# EAGLE design GT_pos_router (EAGLE 9.1.1)
REV: 1; TITLE: GoTab POS Router
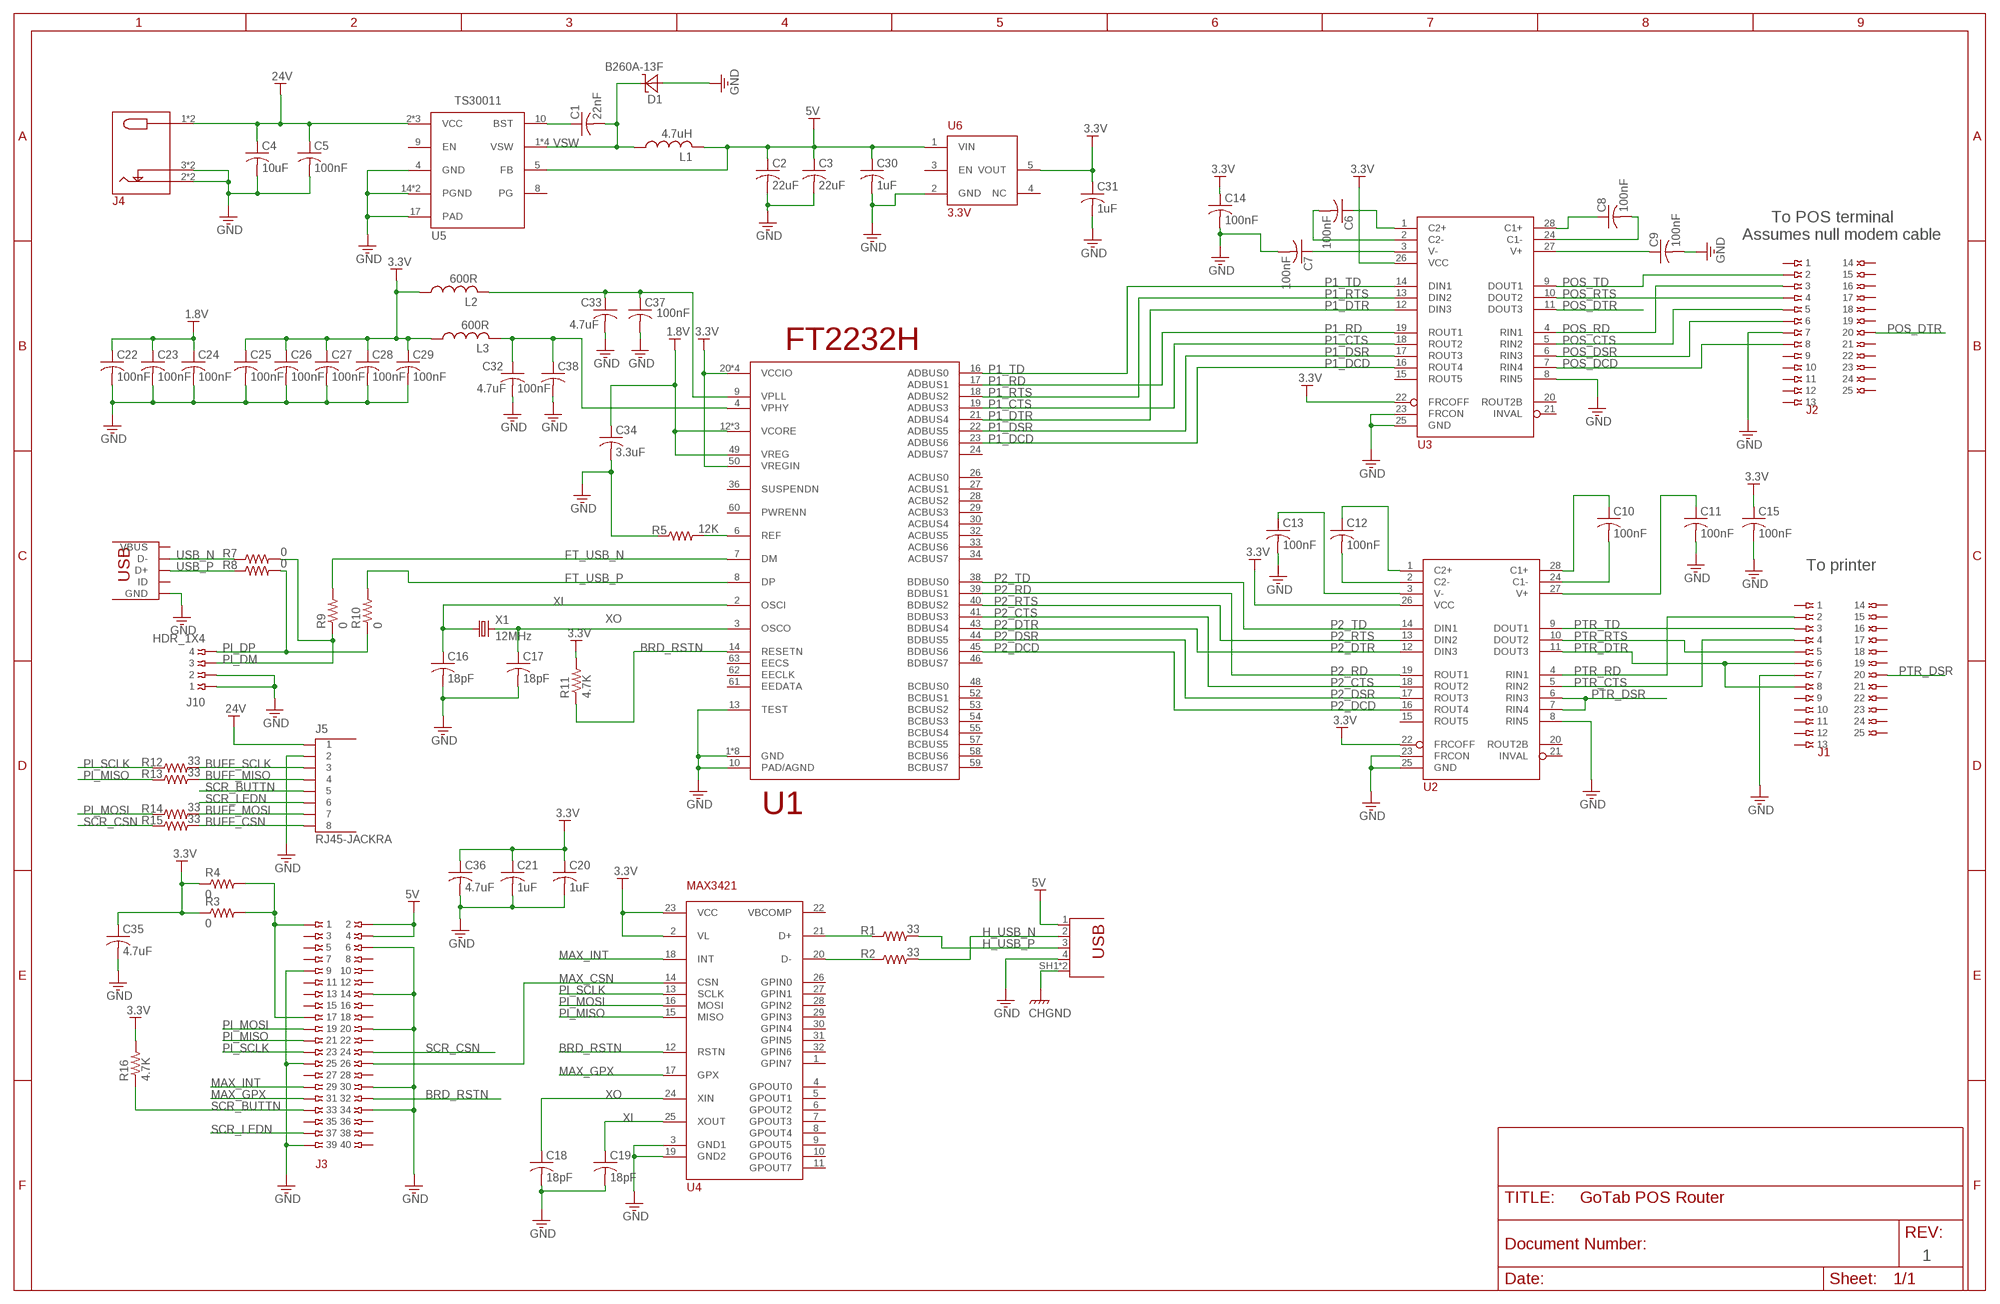
[diagram p0: schematic, sheet 1]

## Parts
C1  22nF  C0402-22NF-16V-10-X7R  [CAPC100X50X55L25N]
C2  22uF  C1206-22UF-25V-20-X5R  [CAPC3216X85L50N]
C3  22uF  C1206-22UF-25V-20-X5R  [CAPC3216X85L50N]
C4  10uF  C1206-10UF-35V-10-X5R  [CAPC3216X85L50N]
C5  100nF  C0603-100NF-50V-5-X7R  [CAPC1608X87L35N]
C6  100nF  C0603-100NF-50V-5-X7R  [CAPC1608X87L35N]
C7  100nF  C0603-100NF-50V-5-X7R  [CAPC1608X87L35N]
C8  100nF  C0603-100NF-50V-5-X7R  [CAPC1608X87L35N]
C9  100nF  C0603-100NF-50V-5-X7R  [CAPC1608X87L35N]
C10  100nF  C0603-100NF-50V-5-X7R  [CAPC1608X87L35N]
C11  100nF  C0603-100NF-50V-5-X7R  [CAPC1608X87L35N]
C12  100nF  C0603-100NF-50V-5-X7R  [CAPC1608X87L35N]
C13  100nF  C0603-100NF-50V-5-X7R  [CAPC1608X87L35N]
C14  100nF  C0603-100NF-50V-5-X7R  [CAPC1608X87L35N]
C15  100nF  C0603-100NF-50V-5-X7R  [CAPC1608X87L35N]
C16  18pF  C0402-18PF-50V-5-NPO  [CAPC100X50X55L25N]
C17  18pF  C0402-18PF-50V-5-NPO  [CAPC100X50X55L25N]
C18  18pF  C0402-18PF-50V-5-NPO  [CAPC100X50X55L25N]
C19  18pF  C0402-18PF-50V-5-NPO  [CAPC100X50X55L25N]
C20  1uF  C0603-1UF-16V-10-X7R  [CAPC1608X87L35N]
C21  1uF  C0603-1UF-16V-10-X7R  [CAPC1608X87L35N]
C22  100nF  C0402-100NF-16V-10-X7R  [CAPC100X50X55L25N]
C23  100nF  C0402-100NF-16V-10-X7R  [CAPC100X50X55L25N]
C24  100nF  C0402-100NF-16V-10-X7R  [CAPC100X50X55L25N]
C25  100nF  C0402-100NF-16V-10-X7R  [CAPC100X50X55L25N]
C26  100nF  C0402-100NF-16V-10-X7R  [CAPC100X50X55L25N]
C27  100nF  C0402-100NF-16V-10-X7R  [CAPC100X50X55L25N]
C28  100nF  C0402-100NF-16V-10-X7R  [CAPC100X50X55L25N]
C29  100nF  C0402-100NF-16V-10-X7R  [CAPC100X50X55L25N]
C30  1uF  C0603-1UF-16V-10-X7R  [CAPC1608X87L35N]
C31  1uF  C0603-1UF-16V-10-X7R  [CAPC1608X87L35N]
C32  4.7uF  C0805-4.7UF-10V-10-X7R  [CAPC2012X140L50N]
C33  4.7uF  C0805-4.7UF-10V-10-X7R  [CAPC2012X140L50N]
C34  3.3uF  C0603-3.3UF-6.3V-10-X5R  [CAPC1608X87L35N]
C35  4.7uF  C0805-4.7UF-10V-10-X7R  [CAPC2012X140L50N]
C36  4.7uF  C0805-4.7UF-10V-10-X7R  [CAPC2012X140L50N]
C37  100nF  C0402-100NF-16V-10-X7R  [CAPC100X50X55L25N]
C38  100nF  C0402-100NF-16V-10-X7R  [CAPC100X50X55L25N]
D1  B260A-13F  [SODFL430X260X240L114X145N]
J1  DB25-RA-MALE  [DB25-RA-MALE]
J2  DB25-RA-FEMALE  [DB25-RA-FEMALE]
J3  RPI_ZERO_HDR0.2_STACK  [RPI_ZERO_HDR]
J4  PWR_JACK_SW_NC  [PJ-202B]
J5  RJ45-JACKRA  [RJ45-RA]
J8  USB-MICRO-B-SMT-FLG  [10118192-0001LF]
J9  USB-A-RECEPT-RA  [SS-52100-001]
J10  HDR_1X4  [HDR_0.1IN_1X4_1MM]
L1  4.7uH  L-SRN4026-4.7UH  [SRN4026]
L2  600R  L0402-600R-0.3A  [INDC100X50X55L25N]
L3  600R  L0402-600R-0.3A  [INDC100X50X55L25N]
R1  33  R0402-33-1/16W/-1  [RESC1005X40L25N]
R2  33  R0402-33-1/16W/-1  [RESC1005X40L25N]
R3  0  R0402-0-1/16W  [RESC1005X40L25N]
R4  0  R0402-0-1/16W  [RESC1005X40L25N]
R5  12K  R0402-12K-1/16W-1  [RESC1005X40L25N]
R7  0  R0402-0-1/16W  [RESC1005X40L25N]
R8  0  R0402-0-1/16W  [RESC1005X40L25N]
R9  0  R0402-0-1/16W  [RESC1005X40L25N]
R10  0  R0402-0-1/16W  [RESC1005X40L25N]
R11  4.7K  R0402-4.7K-1/16W-1  [RESC1005X40L25N]
R12  33  R0402-33-1/16W/-1  [RESC1005X40L25N]
R13  33  R0402-33-1/16W/-1  [RESC1005X40L25N]
R14  33  R0402-33-1/16W/-1  [RESC1005X40L25N]
R15  33  R0402-33-1/16W/-1  [RESC1005X40L25N]
R16  4.7K  R0402-4.7K-1/16W-1  [RESC1005X40L25N]
U1  FT2232H  [LQFP64P050_120X120X160N]
U2  MAX3243ST-EB  [TSSOP28]
U3  MAX3243ST-EB  [TSSOP28]
U4  MAX3421  [TQFP32P050_50X50X120N]
U5  TS30011  [QFN16P05_3X3X10T17X17N]
U6  3.3V  MIC5504  [SOT23-5P95_280X160L40X40N]
X1  12MHz  ABLS2-12M  [ABLS2]

## Nets
1.8V: C22.1 C23.1 C24.1 C34.1 U1.12(VCORE) U1.37(VCORE) U1.49(VREG) U1.64(VCORE)
3.3V: C14.1 C15.1 C20.1 C21.1 C25.1 C26.1 C27.1 C28.1 C29.1 C31.1 C35.1 C36.1 L2.1 L3.1 R3.1 R4.1 R11.2 R16.2 U1.20(VCCIO) U1.31(VCCIO) U1.42(VCCIO) U1.50(VREGIN) U1.56(VCCIO) U2.22(FRCOFF) U2.26(VCC) U3.22(FRCOFF) U3.26(VCC) U4.2(VL) U4.23(VCC) U6.5(VOUT)
5V: C2.1 C3.1 C30.1 J3.2 J3.4 J9.1(VBUS) L1.2 U5.5(FB) U6.1(VIN)
24V: C4.1 C5.1 J4.1 J4.4 J5.1 U5.2(VCC) U5.3(VCC) U5.11(VCC)
BRD_RSTN: J3.32 R11.1 U1.14(RESETN) U4.12(RSTN)
BUFF_CSN: J5.8 R15.2
BUFF_MISO: J5.4 R13.2
BUFF_MOSI: J5.7 R14.2
BUFF_SCLK: J5.3 R12.2
CHGND: J9.SH1(SHELL) J9.SH2(SHELL)
FT_USB_N [USB]: R9.2 U1.7(DM)
FT_USB_P [USB]: R10.2 U1.8(DP)
GND: C2.2 C3.2 C4.2 C5.2 C7.2 C9.2 C11.2 C13.2 C14.2 C15.2 C16.2 C17.2 C18.2 C19.2 C20.2 C21.2 C22.2 C23.2 C24.2 C25.2 C26.2 C27.2 C28.2 C29.2 C30.2 C31.2 C32.2 C33.2 C34.2 C35.2 C36.2 C37.2 C38.2 D1.A J1.7 J2.7 J3.6 J3.9 J3.14 J3.20 J3.25 J3.30 J3.34 J3.39 J4.2 J4.3 J4.5 J4.6 J5.2 J8.5(GND) J9.4(GND) J10.1 J10.2 R5.1 U1.1(GND) U1.5(GND) U1.10(PAD/AGND) U1.11(GND) U1.13(TEST) U1.15(GND) U1.25(GND) U1.35(GND) U1.47(GND) U1.51(GND) U2.8(RIN5) U2.23(FRCON) U2.25(GND) U3.8(RIN5) U3.23(FRCON) U3.25(GND) U4.3(GND1) U4.19(GND2) U5.4(GND) U5.14(PGND) U5.15(PGND) U5.17(PAD) U6.2(GND)
H_USB_N [USB]: J9.2(D-) R2.2
H_USB_P [USB]: J9.3(D+) R1.2
MAX_CSN: J3.26 U4.14(CSN)
MAX_GPX: J3.31 U4.17(GPX)
MAX_INT: J3.29 U4.18(INT)
N$1: R1.1 U4.21(D+)
N$2: R2.1 U4.20(D-)
N$8: C1.1 U5.10(BST)
N$15: C6.1 U3.1(C2+)
N$16: C6.2 U3.2(C2-)
N$17: C7.1 U3.3(V-)
N$18: C33.1 C37.1 L2.2 U1.9(VPLL)
N$19: C8.1 U3.28(C1+)
N$20: C8.2 U3.24(C1-)
N$21: C9.1 U3.27(V+)
N$22: C32.1 C38.1 L3.2 U1.4(VPHY)
N$23: R5.2 U1.6(REF)
N$24: C13.1 U2.3(V-)
N$25: C12.2 U2.2(C2-)
N$26: C12.1 U2.1(C2+)
N$27: C10.1 U2.28(C1+)
N$28: C10.2 U2.24(C1-)
N$29: C11.1 U2.27(V+)
N$31: J3.1 J3.17 R3.2 R4.2
P1_CTS: U1.19(ADBUS3) U3.18(ROUT2)
P1_DCD: U1.23(ADBUS6) U3.16(ROUT4)
P1_DSR: U1.22(ADBUS5) U3.17(ROUT3)
P1_DTR: U1.21(ADBUS4) U3.12(DIN3)
P1_RD: U1.17(ADBUS1) U3.19(ROUT1)
P1_RTS: U1.18(ADBUS2) U3.13(DIN2)
P1_TD: U1.16(ADBUS0) U3.14(DIN1)
P2_CTS: U1.41(BDBUS3) U2.18(ROUT2)
P2_DCD: U1.45(BDBUS6) U2.16(ROUT4)
P2_DSR: U1.44(BDBUS5) U2.17(ROUT3)
P2_DTR: U1.43(BDBUS4) U2.12(DIN3)
P2_RD: U1.39(BDBUS1) U2.19(ROUT1)
P2_RTS: U1.40(BDBUS2) U2.13(DIN2)
P2_TD: U1.38(BDBUS0) U2.14(DIN1)
PI_DM [USB]: J10.3 R7.2 R9.1
PI_DP [USB]: J10.4 R8.2 R10.1
PI_MISO: J3.21 R13.1 U4.15(MISO)
PI_MOSI: J3.19 R14.1 U4.16(MOSI)
PI_SCLK: J3.23 R12.1 U4.13(SCLK)
POS_CTS: J2.5 U3.5(RIN2)
POS_DCD: J2.8 U3.7(RIN4)
POS_DSR: J2.6 U3.6(RIN3)
POS_DTR: J2.20 U3.11(DOUT3)
POS_RD: J2.3 U3.4(RIN1)
POS_RTS: J2.4 U3.10(DOUT2)
POS_TD: J2.2 U3.9(DOUT1)
PTR_CTS: J1.4 U2.5(RIN2)
PTR_DSR: J1.20 U2.6(RIN3) U2.7(RIN4)
PTR_DTR: J1.6 J1.8 U2.11(DOUT3)
PTR_RD: J1.2 U2.4(RIN1)
PTR_RTS: J1.5 U2.10(DOUT2)
PTR_TD: J1.3 U2.9(DOUT1)
SCR_BUTTN: J3.33 J5.5 R16.1
SCR_CSN: J3.24 R15.1
SCR_LEDN: J3.37 J5.6
USB_N [USB]: J8.2(D-) R7.1
USB_P [USB]: J8.3(D+) R8.1
VSW: C1.2 D1.C L1.1 U5.1(VSW) U5.12(VSW) U5.13(VSW) U5.16(VSW)
XI: C16.1 C19.1 U1.2(OSCI) U4.25(XOUT) X1.1
XO: C17.1 C18.1 U1.3(OSCO) U4.24(XIN) X1.2
Unconnected: J1.1 J1.9 J1.10 J1.11 J1.12 J1.13 J1.14 J1.15 J1.16 J1.17 J1.18 J1.19 J1.21 J1.22 J1.23 J1.24 J1.25 J2.1 J2.9 J2.10 J2.11 J2.12 J2.13 J2.14 J2.15 J2.16 J2.17 J2.18 J2.19 J2.21 J2.22 J2.23 J2.24 J2.25 J3.3 J3.5 J3.7 J3.8 J3.10 J3.11 J3.12 J3.13 J3.15 J3.16 J3.18 J3.22 J3.27 J3.28 J3.35 J3.36 J3.38 J3.40 J8.1(VBUS) J8.4(ID) U1.24(ADBUS7) U1.26(ACBUS0) U1.27(ACBUS1) U1.28(ACBUS2) U1.29(ACBUS3) U1.30(ACBUS4) U1.32(ACBUS5) U1.33(ACBUS6) U1.34(ACBUS7) U1.36(SUSPENDN) U1.46(BDBUS7) U1.48(BCBUS0) U1.52(BCBUS1) U1.53(BCBUS2) U1.54(BCBUS3) U1.55(BCBUS4) U1.57(BCBUS5) U1.58(BCBUS6) U1.59(BCBUS7) U1.60(PWRENN) U1.61(EEDATA) U1.62(EECLK) U1.63(EECS) U2.15(ROUT5) U2.20(ROUT2B) U2.21(INVAL) U3.15(ROUT5) U3.20(ROUT2B) U3.21(INVAL) U4.1(GPIN7) U4.4(GPOUT0) U4.5(GPOUT1) U4.6(GPOUT2) U4.7(GPOUT3) U4.8(GPOUT4) U4.9(GPOUT5) U4.10(GPOUT6) U4.11(GPOUT7) U4.26(GPIN0) U4.27(GPIN1) U4.28(GPIN2) U4.29(GPIN3) U4.30(GPIN4) U4.31(GPIN5) U4.32(GPIN6) U5.8(PG) U5.9(EN) U6.3(EN) U6.4(NC)

## Notes on the sheet
- To POS terminal
- Assumes null modem cable
- To printer
- 1

## Power pins joined to a net without a drawn wire
VBCOMP: U4.22(VBCOMP)

## Library data of the parts
C1 = passive:C0402: Capacitor, Chip; 1.00 mm L X 0.50 mm W X 0.55 mm H; HEIGHT: 0.55; ROYPN: 200-0075; TEMP: X7R; TOL: 10%; VOLTAGE: 16V
C2 C3 = passive:C1206: Capacitor, Chip; 3.20 mm L X 1.60 mm W. Height variable; HEIGHT: 1.8; ROYPN: 200-0076; TEMP: X5R; TOL: 20%; VOLTAGE: 25V
C4 = passive:C1206: Capacitor, Chip; 3.20 mm L X 1.60 mm W. Height variable; HEIGHT: 0.87; ROYPN: 200-0008; TEMP: X5R; TOL: 10%; VOLTAGE: 35V
C5-C15 = passive:C0603: Capacitor, Chip; 1.60 mm L X 0.80 mm W X 0.87 mm H; HEIGHT: 0.9; ROYPN: 200-0078; TEMP: X7R; TOL: 5%; VOLTAGE: 50V
C16-C19 = passive:C0402: Capacitor, Chip; 1.00 mm L X 0.50 mm W X 0.55 mm H; HEIGHT: 0.55; ROYPN: 200-0055; TOL: 5%; VOLTAGE: 50V
C20 C21 C30 C31 = passive:C0603: Capacitor, Chip; 1.60 mm L X 0.80 mm W X 0.87 mm H; HEIGHT: 0.87; ROYPN: 200-0007; TEMP: X7R; TOL: 10%; VOLTAGE: 16V
C22-C29 C37 C38 = passive:C0402: Capacitor, Chip; 1.00 mm L X 0.50 mm W X 0.55 mm H; HEIGHT: 0.55; ROYPN: 200-0001; TEMP: X7R; TOL: 10%; VOLTAGE: 16V
C32 C33 C35 C36 = passive:C0805: Capacitor, Chip; 2.00 mm L X 1.25 mm W X 1.40 mm H; HEIGHT: 1.35; ROYPN: 200-0081; TEMP: X7R; TOL: 10%; VOLTAGE: 10V
C34 = passive:C0603: Capacitor, Chip; 1.60 mm L X 0.80 mm W X 0.87 mm H; HEIGHT: 0.9; ROYPN: 200-0083; TEMP: X5R; TOL: 10%; VOLTAGE: 6.3V
D1 = passive:B260A-13F: Schottky diode, 2A Datasheet <http://www.diodes.com/_files/datasheets/ds13004.pdf>; HEIGHT: 2.3; MAXCURRENT: 2A; MAXVOLTAGE: 60V; ROYPN: 200-0022; TYPE: Schottky
J1 = mechanical:DB25-RA-MALE; HEIGHT: 12.55; ROYPN: 320-0045
J2 = mechanical:DB25-RA-FEMALE; HEIGHT: 12.55; ROYPN: 320-0044
J3 = mechanical:RPI_ZERO_HDR; HEIGHT: 5.12; ROYPN: 320-0042
J4 = mechanical:PWR_JACK_SW_NC: Power entry Jack 2.5mm I.D. 5.5mm O.D. 24VDC, 2.5A with NC switch; HEIGHT: 11; ROYPN: 320-0022
J5 = mechanical:RJ45-JACK: RJ45 through hole right angle, unshielded; HEIGHT: 13.3; ROYPN: 320-0047
J8 = mechanical:USB: USB 5-pin receptacles; HEIGHT: 2.7; ROYPN: 320-0001
J9 = mechanical:USB-A-RECEPT-RA; HEIGHT: 6.9; ROYPN: 320-0041
J10 = mechanical:HDR_1X4: 4-pin SIL header, 0.1in; HEIGHT: 8.38; ROYPN: 320-0023
L1 = passive:L-SRN4026: Inductor, fixed, SRN4026, 4.0mm diameter, 2.5mm H; CURRENT: 1.4; HEIGHT: 2.5; RESISTANCE: 48mohm; ROYPN: 200-0074
L2 L3 = passive:L0402: Inductor, Chip; 1.00 mm L X 0.50 mm W X 0.55 mm H; CURRENT: 0.3A; HEIGHT: 0.55; ROYPN: 200-0080
R1 R2 R12-R15 = passive:R0402: Resistor, Chip; 1.00 mm L X 0.50 mm W X 0.40 mm H; HEIGHT: 0.4; POWER: 1/16W; ROYPN: 200-0077; TOL: 1%
R3 R4 R7-R10 = passive:R0402: Resistor, Chip; 1.00 mm L X 0.50 mm W X 0.40 mm H; HEIGHT: 0.4; POWER: 1/16W; ROYPN: 200-0045
R5 = passive:R0402: Resistor, Chip; 1.00 mm L X 0.50 mm W X 0.40 mm H; HEIGHT: 0.4; POWER: 1/16W; ROYPN: 200-0082; TOL: 1%
R11 R16 = passive:R0402: Resistor, Chip; 1.00 mm L X 0.50 mm W X 0.40 mm H; HEIGHT: 0.4; POWER: 1/16W; ROYPN: 200-0012; TOL: 1%
U1 = communication:FT2232H: FT2232H High speed USB to dual UART; HEIGHT: 1.6; ROYPN: 210-0047
U2 U3 = communication:MAX3243; HEIGHT: 1.2; ROYPN: 210-0044
U4 = communication:MAX3421: SPI to USB host/peripheral controller; HEIGHT: 1.2; ROYPN: 210-0045
U5 = power:TS30011: Synchronous Buck converter, 1A; HEIGHT: 1.0; ROYPN: 210-0046
U6 = power:MIC5504: 2.5-5.5V in LDO; CURRENT: 300mA; ROYPN: 210-0048
X1 = clocks:ABLS2: ABLS2 2 pin crystal; CAP: 18pF; HEIGHT: 3.3; ROYPN: 200-0079; TOL: 30ppm

## Net classes
1 USB: width 0.26 mm, drill 0.3 mm, clearance 0.004 mm

## Board
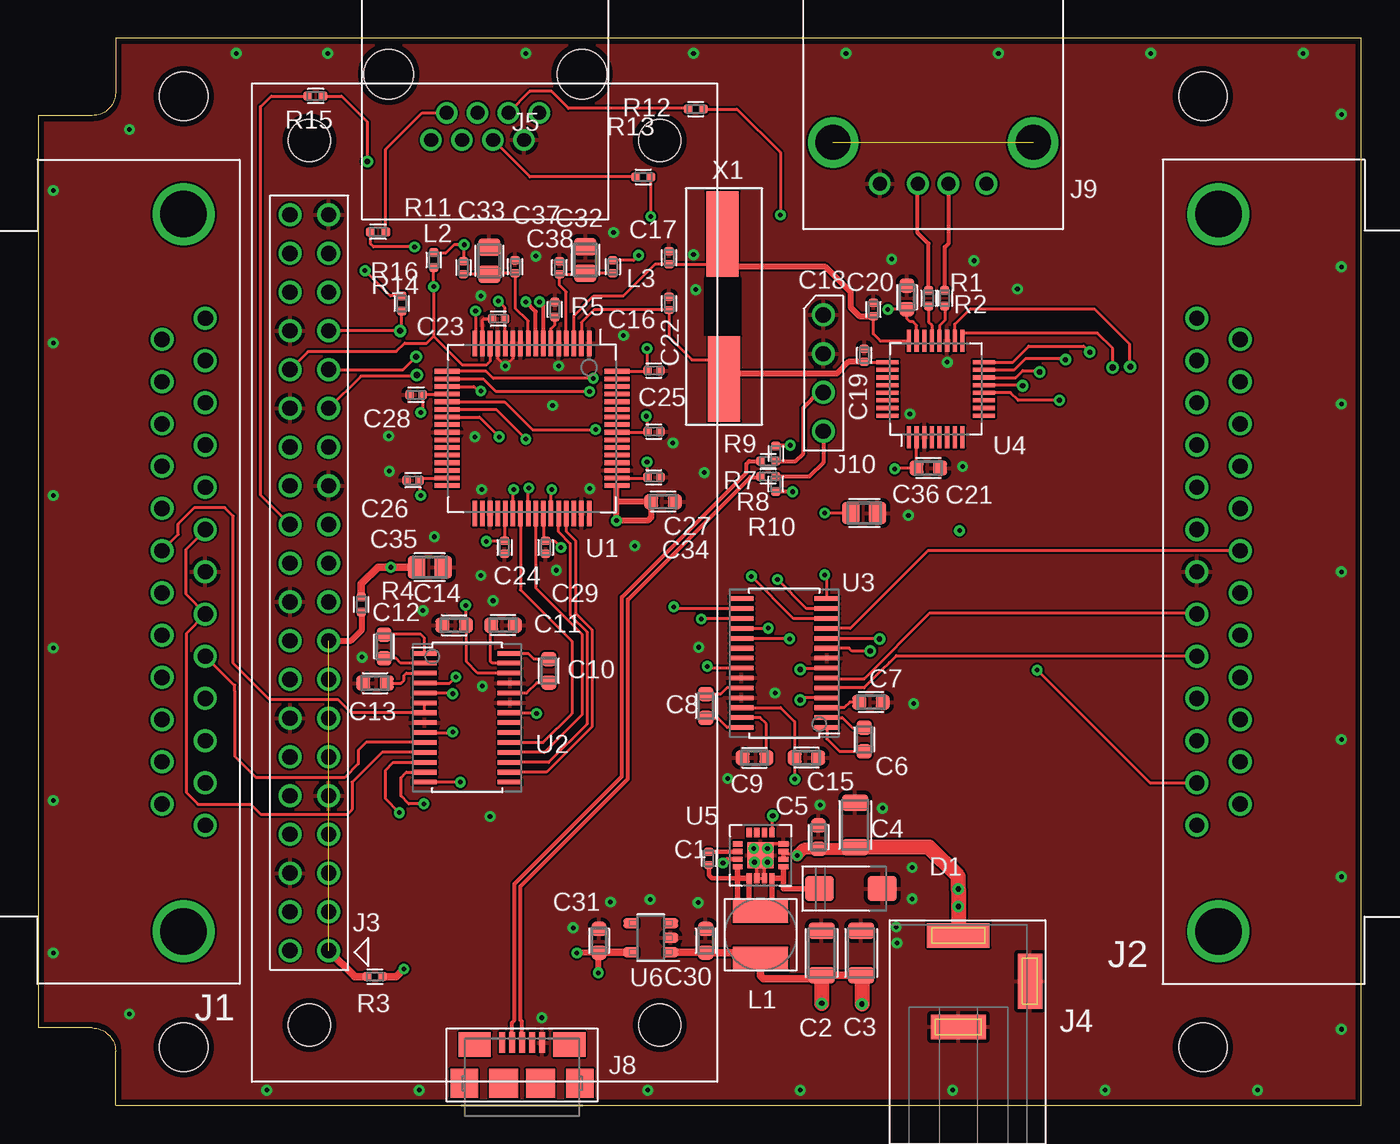
[diagram p1: board, top side]
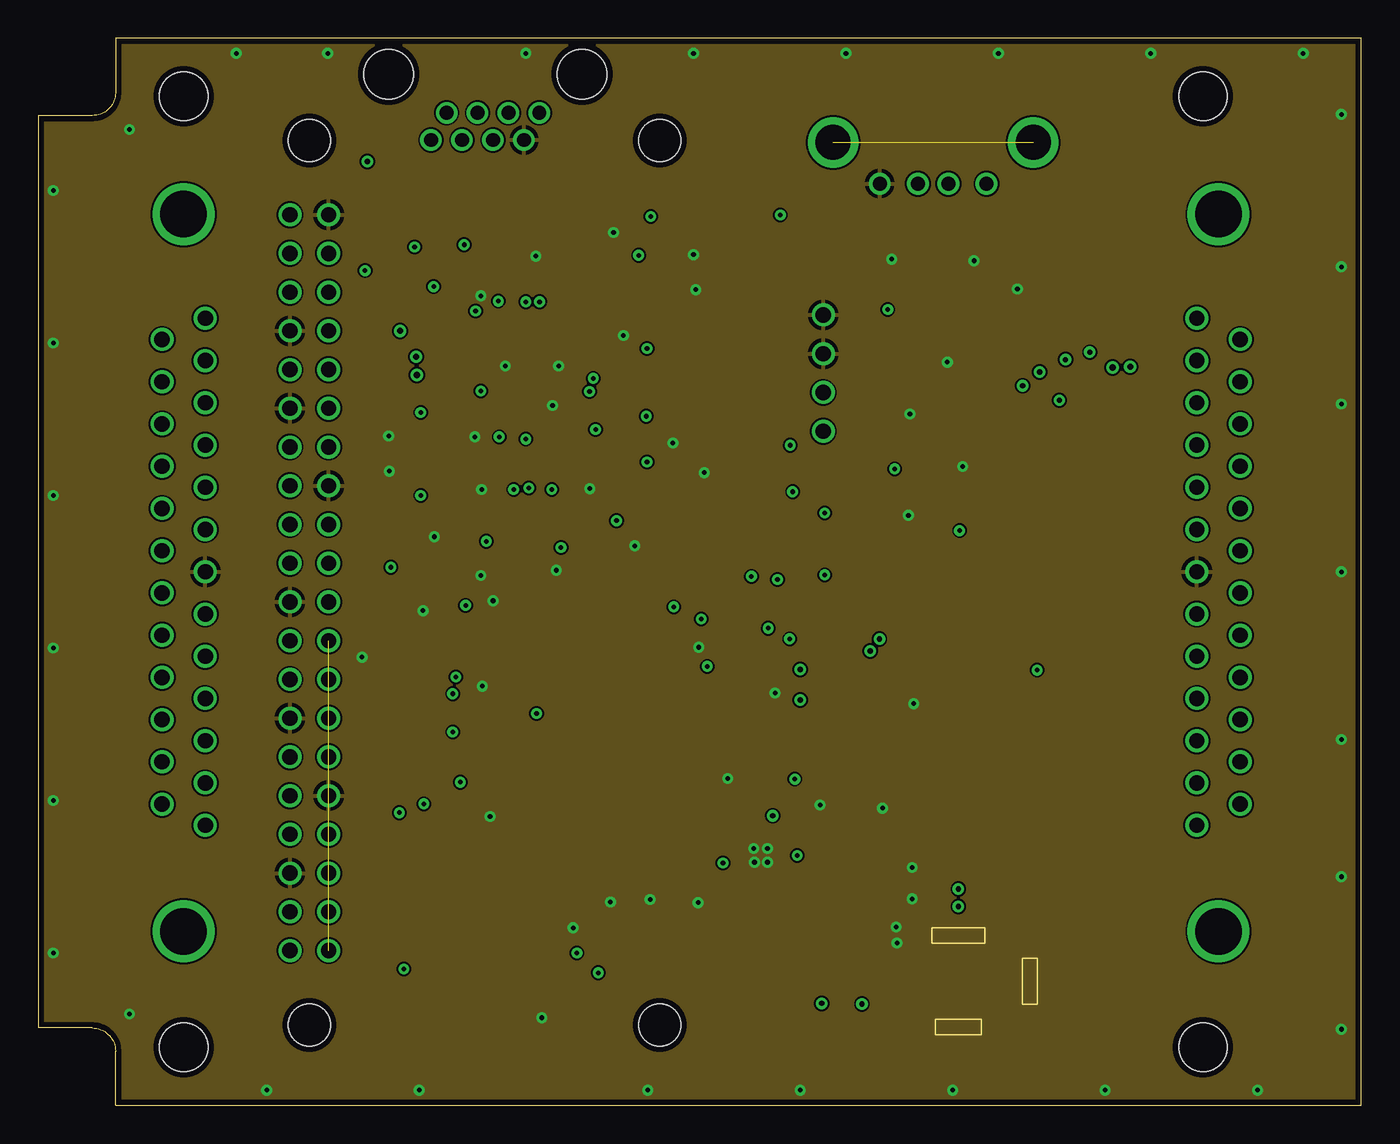
[diagram p2: board, inner layer Route2]
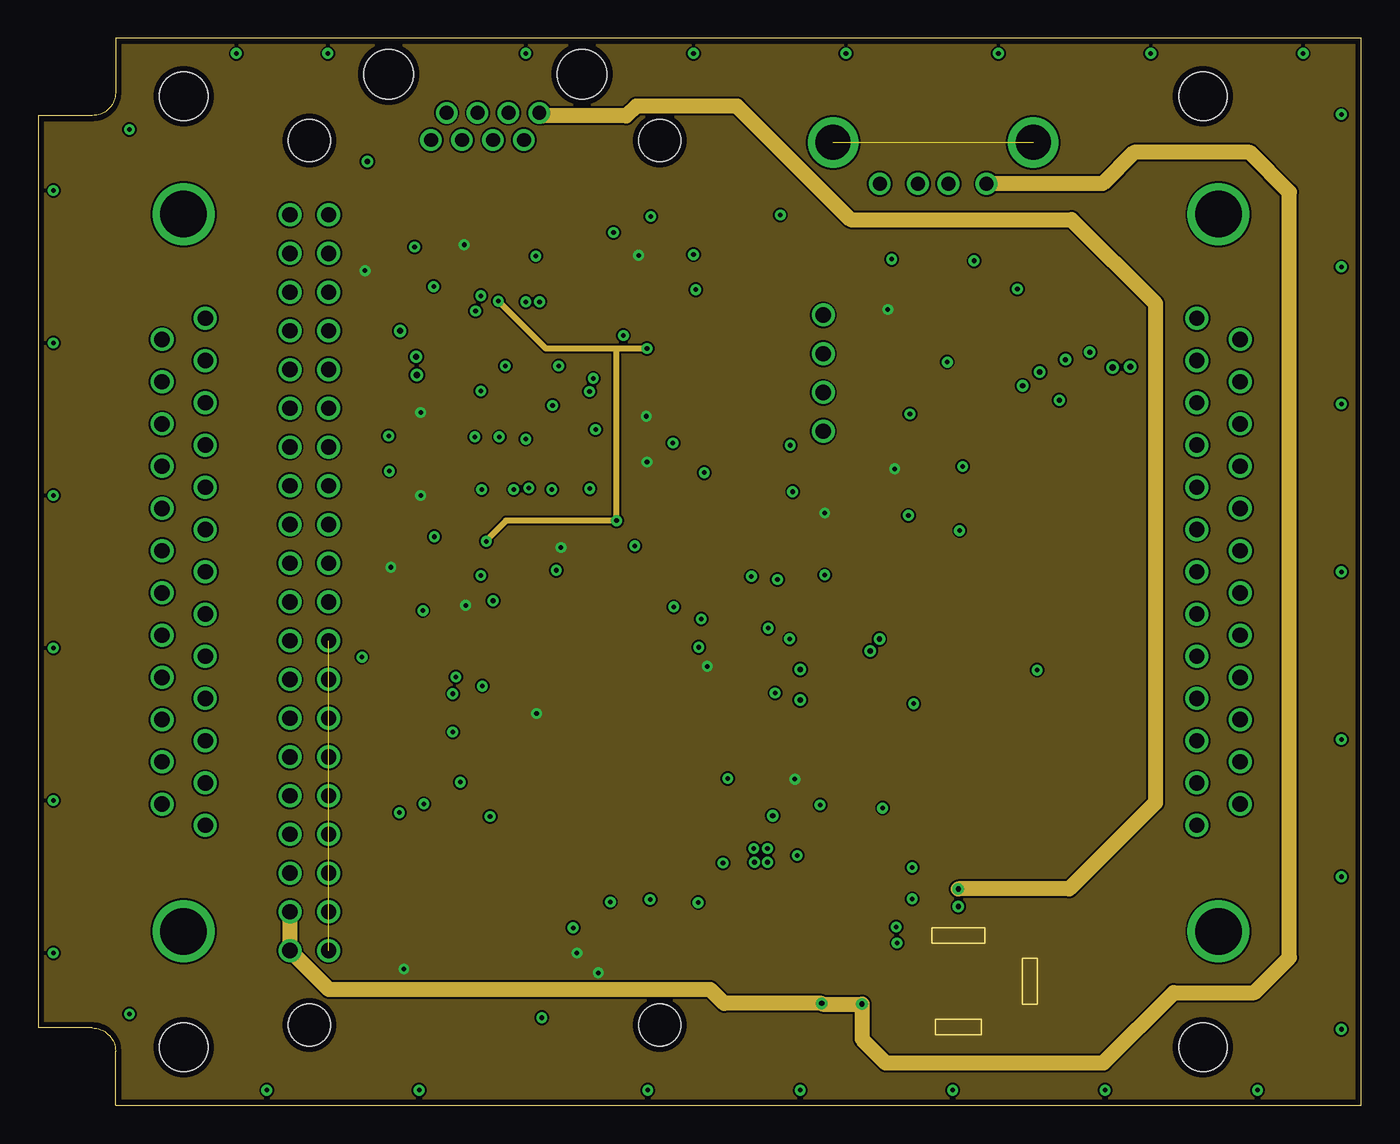
[diagram p3: board, inner layer Route15]
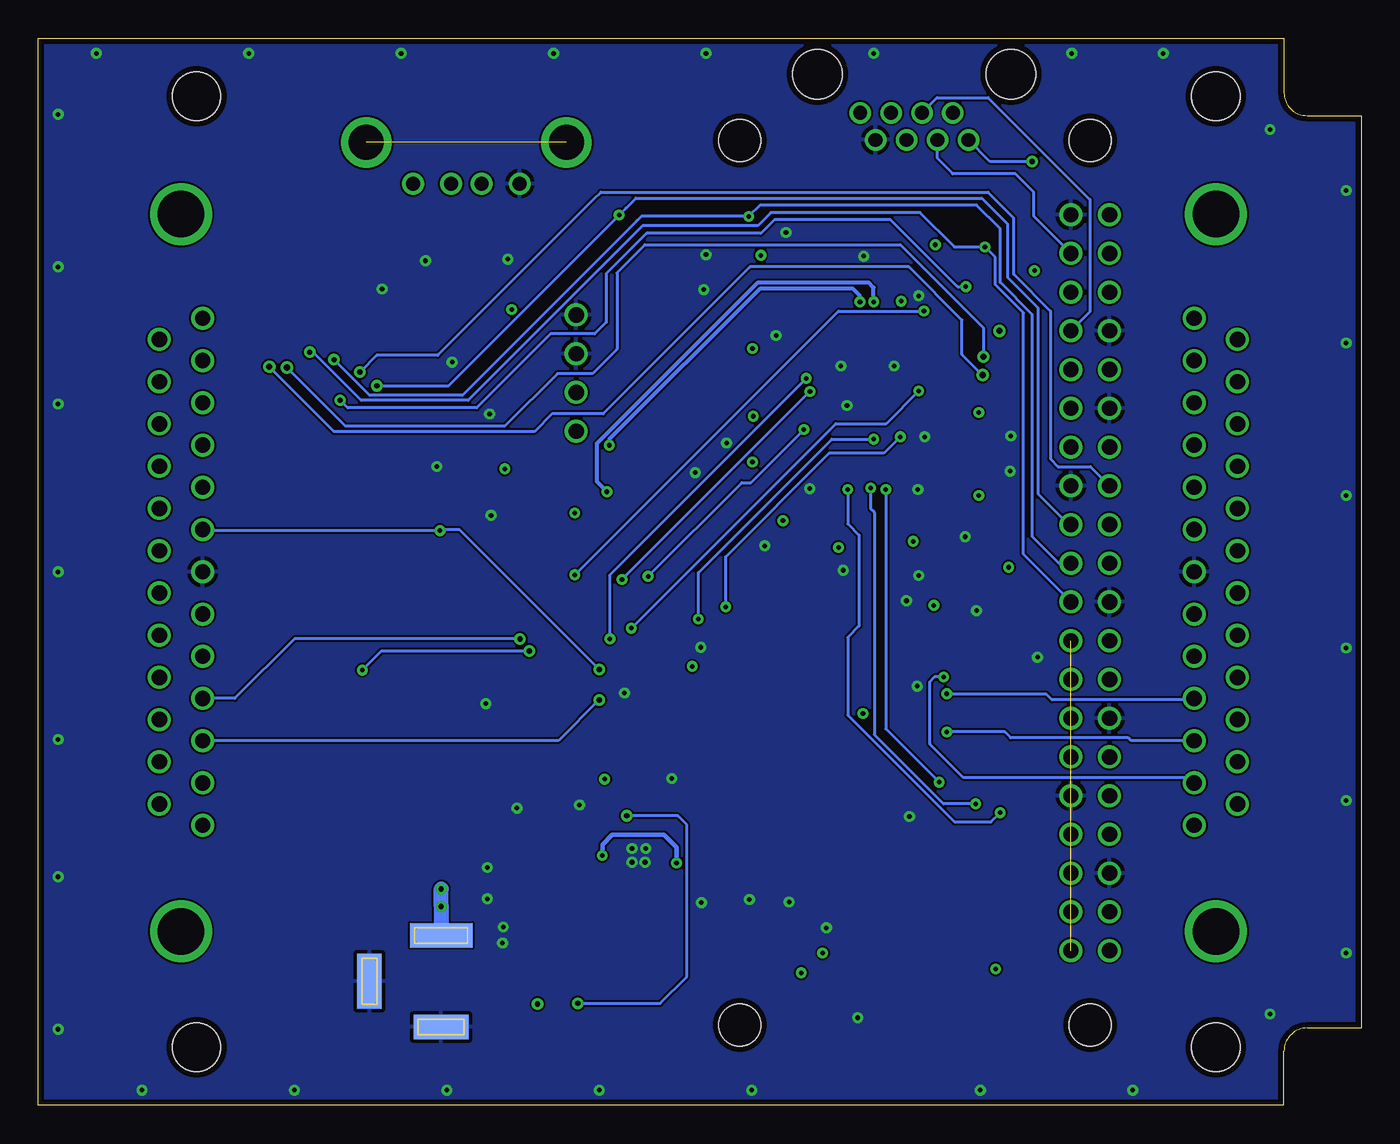
[diagram p4: board, bottom side, seen from below]

Size 86.82 x 70 mm. Coordinates in mm from the lower left corner, seen from the top.
Outline: 5.08,0 86.82,0 86.82,70 5.08,70 5.08,66.42 arc-90 3.56,64.92 0,64.92 0,5.08 3.56,5.08 arc-90 5.08,3.56 5.08,0
Copper layers (1+2*15+16): Top 0.035mm / dielectric 10mil / Route2 0.035mm / dielectric 38mil / Route15 0.035mm / dielectric 10mil / Bottom 0.035mm
Design rules "bittele *": minimum track width 5mil, minimum drill 0.2mm, track to track 5mil, track to pad 5mil, pad to pad 5mil, via to via 6mil, smd to smd 0mil, copper to edge 15mil, drill to drill 8mil, minimum pad ring 10mil, minimum via ring 8mil, stop-mask expansion 4mil, vias tented up to drill 30mil, thermal gap 10mil
Holes 3.17 mm at 76.43,66.19 76.43,3.81 9.55,66.19 9.55,3.81
tRestrict: 4 lines

### Footprints (pad centres in the part's own frame; a part is rotated, then mirrored left to right if it is on the bottom)
CAPC100X50X55L25N = smd 0.54 x 0.6: 1 -0.43,0; 2 0.43,0
CAPC3216X85L50N = smd 1.1 x 1.72: 1 -1.46,0; 2 1.46,0
CAPC1608X87L35N = smd 0.92 x 0.97: 1 -0.775,0; 2 0.775,0
CAPC2012X140L50N = smd 1.16 x 1.47: 1 -0.875,0; 2 0.875,0
SODFL430X260X240L114X145N = smd 1.88 x 1.65: A 2.06,0; C -2.06,0
DB25-RA-MALE = drill 1: 1 0,0; 2 2.77,0; 3 5.54,0; 4 8.31,0; 5 11.08,0; 6 13.85,0; 7 16.62,0; 8 19.39,0; 9 22.16,0; 10 24.93,0; 11 27.7,0; 12 30.47,0; 13 33.24,0; 14 1.385,2.84; 15 4.155,2.84; 16 6.925,2.84; 17 9.695,2.84; 18 12.465,2.84; 19 15.235,2.84; 20 18.005,2.84; 21 20.775,2.84; 22 23.545,2.84; 23 26.315,2.84; 24 29.085,2.84; 25 31.855,2.84 | drill 3.05: M1 -6.96,1.42; M2 40.08,1.42
DB25-RA-FEMALE = drill 1: 1 0,0; 2 2.77,0; 3 5.54,0; 4 8.31,0; 5 11.08,0; 6 13.85,0; 7 16.62,0; 8 19.39,0; 9 22.16,0; 10 24.93,0; 11 27.7,0; 12 30.47,0; 13 33.24,0; 14 1.385,-2.84; 15 4.155,-2.84; 16 6.925,-2.84; 17 9.695,-2.84; 18 12.465,-2.84; 19 15.235,-2.84; 20 18.005,-2.84; 21 20.775,-2.84; 22 23.545,-2.84; 23 26.315,-2.84; 24 29.085,-2.84; 25 31.855,-2.84 | drill 3.05: M1 -6.96,-1.42; M2 40.08,-1.42
RPI_ZERO_HDR = drill 1: 1 0,0; 2 0,2.54; 3 2.54,0; 4 2.54,2.54; 5 5.08,0; 6 5.08,2.54; 7 7.62,0; 8 7.62,2.54; 9 10.16,0; 10 10.16,2.54; 11 12.7,0; 12 12.7,2.54; 13 15.24,0; 14 15.24,2.54; 15 17.78,0; 16 17.78,2.54; 17 20.32,0; 18 20.32,2.54; 19 22.86,0; 20 22.86,2.54; 21 25.4,0; 22 25.4,2.54; 23 27.94,0; 24 27.94,2.54; 25 30.48,0; 26 30.48,2.54; 27 33.02,0; 28 33.02,2.54; 29 35.56,0; 30 35.56,2.54; 31 38.1,0; 32 38.1,2.54; 33 40.64,0; 34 40.64,2.54; 35 43.18,0; 36 43.18,2.54; 37 45.72,0; 38 45.72,2.54; 39 48.26,0; 40 48.26,2.54 | hole 2.75: -4.87,1.27; 53.13,1.27; -4.87,-21.73; 53.13,-21.73
PJ-202B = smd 1.6 x 4.1: 1 -6.5,0 | smd 1.6 x 3.6: 2 -0.5,0 | smd 3.6 x 1.6: 3 -3.5,4.7 | smd 1.6 x 4.1 bottom: 4 -6.5,0 | smd 1.6 x 3.6 bottom: 5 -0.5,0 | smd 3.6 x 1.6 bottom: 6 -3.5,4.7
RJ45-RA = drill 0.9: 1 0,0; 2 1.016,1.78; 3 2.031,0; 4 3.047,1.78; 5 4.06,0; 6 5.079,1.78; 7 6.09,0; 8 7.11,1.78 | hole 3.25: -2.79,-2.54; 9.9,-2.54
10118192-0001LF = smd 0.4 x 1.35: 1 -1.3,2.675; 2 -0.65,2.675; 3 0,2.675; 4 0.65,2.675; 5 1.3,2.675 | smd 2.1 x 1.6: S1 -3.1,2.55; S2 3.1,2.55 | smd 1.8 x 1.9: S3 -3.8,0; S6 3.8,0 | smd 1.9 x 1.9: S4 -1.2,0; S5 1.2,0
SS-52100-001 = drill 0.92: 1 0,0; 2 2.5,0; 3 4.5,0; 4 7,0 | drill 2.3: SH1 -3.07,-2.71; SH2 10.07,-2.71
HDR_0.1IN_1X4_1MM = drill 1: 1 -3.81,0; 2 -1.27,0; 3 1.27,0; 4 3.81,0
SRN4026 = smd 3.6 x 1.5: 1 0,1.525; 2 0,-1.525
INDC100X50X55L25N = smd 0.54 x 0.6: 1 -0.43,0; 2 0.43,0
RESC1005X40L25N = smd 0.6 x 0.6: 1 -0.5,0; 2 0.5,0
LQFP64P050_120X120X160N = smd 0.3 x 1.65: 1 -3.75,-5.575; 2 -3.25,-5.575; 3 -2.75,-5.575; 4 -2.25,-5.575; 5 -1.75,-5.575; 6 -1.25,-5.575; 7 -0.75,-5.575; 8 -0.25,-5.575; 9 0.25,-5.575; 10 0.75,-5.575; 11 1.25,-5.575; 12 1.75,-5.575; 13 2.25,-5.575; 14 2.75,-5.575; 15 3.25,-5.575; 16 3.75,-5.575; 33 3.75,5.575; 34 3.25,5.575; 35 2.75,5.575; 36 2.25,5.575; 37 1.75,5.575; 38 1.25,5.575; 39 0.75,5.575; 40 0.25,5.575; 41 -0.25,5.575; 42 -0.75,5.575; 43 -1.25,5.575; 44 -1.75,5.575; 45 -2.25,5.575; 46 -2.75,5.575; 47 -3.25,5.575; 48 -3.75,5.575 | smd 1.65 x 0.3: 17 5.575,-3.75; 18 5.575,-3.25; 19 5.575,-2.75; 20 5.575,-2.25; 21 5.575,-1.75; 22 5.575,-1.25; 23 5.575,-0.75; 24 5.575,-0.25; 25 5.575,0.25; 26 5.575,0.75; 27 5.575,1.25; 28 5.575,1.75; 29 5.575,2.25; 30 5.575,2.75; 31 5.575,3.25; 32 5.575,3.75; 49 -5.575,3.75; 50 -5.575,3.25; 51 -5.575,2.75; 52 -5.575,2.25; 53 -5.575,1.75; 54 -5.575,1.25; 55 -5.575,0.75; 56 -5.575,0.25; 57 -5.575,-0.25; 58 -5.575,-0.75; 59 -5.575,-1.25; 60 -5.575,-1.75; 61 -5.575,-2.25; 62 -5.575,-2.75; 63 -5.575,-3.25; 64 -5.575,-3.75
TSSOP28 = smd 0.3 x 1.6: 1 -4.225,-2.8; 2 -3.575,-2.8; 3 -2.925,-2.8; 4 -2.275,-2.8; 5 -1.625,-2.8; 6 -0.975,-2.8; 7 -0.325,-2.8; 8 0.325,-2.8; 9 0.975,-2.8; 10 1.625,-2.8; 11 2.275,-2.8; 12 2.925,-2.8; 13 3.575,-2.8; 14 4.225,-2.8; 15 4.225,2.8; 16 3.575,2.8; 17 2.925,2.8; 18 2.275,2.8; 19 1.625,2.8; 20 0.975,2.8; 21 0.325,2.8; 22 -0.325,2.8; 23 -0.975,2.8; 24 -1.625,2.8; 25 -2.275,2.8; 26 -2.925,2.8; 27 -3.575,2.8; 28 -4.225,2.8
TQFP32P050_50X50X120N = smd 0.27 x 1.45: 1 -1.75,-3.16; 2 -1.25,-3.16; 3 -0.75,-3.16; 4 -0.25,-3.16; 5 0.25,-3.16; 6 0.75,-3.16; 7 1.25,-3.16; 8 1.75,-3.16; 17 1.75,3.16; 18 1.25,3.16; 19 0.75,3.16; 20 0.25,3.16; 21 -0.25,3.16; 22 -0.75,3.16; 23 -1.25,3.16; 24 -1.75,3.16 | smd 1.45 x 0.27: 9 3.16,-1.75; 10 3.16,-1.25; 11 3.16,-0.75; 12 3.16,-0.25; 13 3.16,0.25; 14 3.16,0.75; 15 3.16,1.25; 16 3.16,1.75; 25 -3.16,1.75; 26 -3.16,1.25; 27 -3.16,0.75; 28 -3.16,0.25; 29 -3.16,-0.25; 30 -3.16,-0.75; 31 -3.16,-1.25; 32 -3.16,-1.75
QFN16P05_3X3X10T17X17N = smd 0.35 x 0.65: 1 -0.75,-1.5; 2 -0.25,-1.5; 3 0.25,-1.5; 4 0.75,-1.5; 9 0.75,1.5; 10 0.25,1.5; 11 -0.25,1.5; 12 -0.75,1.5 | smd 0.65 x 0.35: 5 1.5,-0.75; 6 1.5,-0.25; 7 1.5,0.25; 8 1.5,0.75; 13 -1.5,0.75; 14 -1.5,0.25; 15 -1.5,-0.25; 16 -1.5,-0.75 | smd 1.7 x 1.7: 17 0,0
SOT23-5P95_280X160L40X40N = smd 0.66 x 1: 1 -0.95,-1.3; 2 0,-1.3; 3 0.95,-1.3; 4 0.95,1.3; 5 -0.95,1.3
ABLS2 = smd 5.6 x 2.1: 1 -4.75,0; 2 4.75,0.1

### Placement (x,y rotation side)
C1  44,16.2 270 top
C2  51.4,10 90 top
C3  54,10 90 top
C4  53.6,18.4 90 top
C5  51.2,17.6 90 top
C6  54.2,24 90 top
C7  54.65,26.45 0 top
C8  43.8,26.2 90 top
C9  47,22.8 180 top
C10  33.5,28.5 270 top
C11  30.5,31.5 0 top
C12  22.7,30.1 270 top
C13  22.1,27.7 180 top
C14  27.3,31.5 180 top
C15  50.4,22.8 0 top
C16  41.4,52.6 90 top
C17  41.4,55.6 90 top
C18  54.8,52.2 90 top
C19  54.2,49.2 90 top
C20  57,53 90 top
C21  58.4,41.8 0 top
C22  40.4,48.2 0 top
C23  30.2,51.6 180 top
C24  30.6,36.6 270 top
C25  40.4,44.2 0 top
C26  24.6,41 180 top
C27  40.4,41.2 0 top
C28  24.8,46.6 180 top
C29  33.3,36.6 270 top
C30  43.8,10.8 90 top
C31  36.8,10.8 90 top
C32  35.9,55.45 90 top
C33  29.6,55.4 90 top
C34  41,39.6 0 top
C35  25.7,35.3 0 top
C36  54.2,38.85 0 top
C37  31.3,55 90 top
C38  34.2,54.95 90 top
D1  53.32,14.22 0 top
DRILEGEND  [DRILEGEND]  -10.75,-12.72 0 top  (outside the outline)
J1  10.97,18.38 90 top
J2  76.02,18.38 90 top
J3  19.06,10.16 90 top
J4  60.38,4.65 270 top
J5  32.89,65.1 180 top
J8  31.75,1.45 0 top
J9  62.22,60.45 180 top
J10  51.51,48.03 270 top
L1  47.4,11.2 0 top
L2  27.9,54.95 270 top
L3  37.7,55 270 top
R1  58.42,52.94 90 top
R2  59.49,52.94 90 top
R3  22.1,8.45 180 top
R4  21.2,32.85 270 top
R5  33.9,52.2 270 top
R7  47.9,42.25 0 top
R8  47.9,41.25 0 top
R9  48.4,42.75 90 top
R10  48.4,40.75 270 top
R11  25.95,55.45 90 top
R12  43.15,65.35 180 top
R13  39.7,60.9 180 top
R14  22.3,57.3 0 top
R15  18.2,66.2 0 top
R16  23.85,52.6 90 top
U1  32.4,44.4 180 top
U2  28.15,25.43 270 top
U3  48.95,29.01 90 top
U4  58.89,46.99 0 top
U5  47.4,16.4 90 top
U6  40.2,11 90 top
U$3  [FRAME_A_L]  -90.81,-97.16 0 top  (outside the outline)
U$4  [DOCFIELD]  83.19,-97.16 0 top  (outside the outline)
X1  45,52.4 90 top

### Tracks (layer width: path | path; a pad name or v marks a point on that pad's centre or on a via)
1.8V  (via drill 0.3)
  Top 0.2: U1.37 30.65,37.08 C24.1 29.43,37.03 v29.4,37 | U1.64 39.92,48.15 C22.1 39.95,48.22 v39.95,49.65 | U1.12 30.63,49.99 C23.1 30.63,52.32 v30.2,52.75 | 37.95,40.62 U1.49
  Top 0.4: 37.95,39.6 v37.95,38.35 40,38.35 40.23,38.58 C34.1 37.95,39.6 | 37.95,39.6 37.95,40.62
  Route15 0.2: 29.4,37.05 v29.4,37
  Route15 0.4: 29.4,37.05 30.7,38.35 v37.95,38.35 37.95,49.6 38,49.65 | v30.2,52.75 33.3,49.65 38,49.65 | 38,49.65 v39.95,49.65
3.3V  (via drill 0.3)
  Top 0.2: U1.20 25.28,46.65 C28.1 25.23,45.58 v25.1,45.45 | U1.31 25.18,41.15 C26.1 25.03,40.07 v25.1,40 | U1.50 39.92,41.15 C27.1 39.97,42.18 v39.95,42.2 | U1.56 39.92,44.15 C25.1 39.97,45.13 v39.9,45.2 | U2.26 28.84,28.36 28.1,29.1 28.1,31.48 C14.1 28.07,32.77 v28.05,32.8 | U3.26 48.72,26.09 49.62,25.18 C15.1 49.62,21.43 v49.65,21.4 | U4.2 57.62,43.81 C21.1 56.25,41.8 v56.2,41.75 | U4.23 57.64,51.16 57.4,51.4 57.2,51.4 57,51.6 C20.1 55.77,52.23 v55.75,52.2 | U1.42 33.15,37.18 C29.1 33.88,37.03 v34.31,36.6 | 35.38,10.03 v35.35,10 | C31.1 36.75,9.97 | R16.2 23.1,53.1 v21.45,54.75 | U3.22 44.02,28.68 v43.9,28.8 | U2.22 32.65,25.75 v32.7,25.7 | C36.1 v51.6,38.85 | L2.1 27.95,55.43 v27.95,56.45 27.3,56.45 26.75,55.9 26,55.9 R11.2 | v39.4,55.76 39.07,55.43 L3.1
  Top 0.4: C31.1 35.38,10.03 | 36.75,9.97 v36.75,8.7
  Top 0.5: U6.5 36.83,10.05 C31.1 | C35.1 v23.15,35.3 22.3,35.3 21.2,34.2 R4.1 | R3.1 23.5,8.45 v24,8.95
  pour Route15: 5.1,70 86.82,70 86.82,0 5.1,0 5.05,0.1 5.05,4.05 4,5.1 0,5.1 0,64.9 3.65,64.9 5.1,66.35
5V  (via drill 0.35)
  Top 0.2: v48.2,19 48.15,18.95 U5.5
  Top 0.5: U6.1 43.77,10.05 C30.1 47.05,10.03 L1.2 47.4,8.5 47.6,8.3 51.16,8.3 C2.1 C3.1
  Top 1: C2.1 v51.4,6.7 | C3.1 54.05,8.49 v54.05,6.65
  Route15 1: J3.4 J3.2 19.08,7.6 44.1,7.6 45,6.7 v51.4,6.7 51.45,6.65 v54.05,6.65 54.05,4.35 55.6,2.8 69.9,2.8 74.5,7.4 79.8,7.4 82.1,9.7 82.1,59.9 79.5,62.5 71.9,62.5 69.85,60.45 J9.1
  Bottom 0.2: v51.4,6.7 46,6.7 44.25,8.45 44.25,18.4 44.85,19 v48.2,19
24V  (via drill 0.3, 0.35)
  Top 0.2: U5.3 49.05,16.5 49.7,16.5 v49.8,16.4
  Top 0.3: U5.3 U5.2 | U5.11 45.18,16.15 v44.93,15.9
  Top 0.8: C4.1 53.48,16.82 C5.1 50.23,16.82 v49.8,16.4
  Top 1: C4.1 58.46,16.94 60.38,15.02 v60.38,14.2 J4.1
  Route15 1: v60.38,14.2 67.65,14.2 73.3,19.85 73.3,52.6 67.8,58.1 53.3,58.1 45.85,65.55 39.25,65.55 38.6,64.9 33.09,64.9 J5.1
  Bottom 0.3: v49.8,16.4 49.8,17.1 49.15,17.75 45.75,17.75 44.93,16.93 v44.93,15.9
  Bottom 1: J4.1 v60.38,13.05 v60.38,14.2
BRD_RSTN  (via drill 0.3)
  Top 0.2: U1.14 29.65,48.8 29.4,48.55 27.85,48.55 25.95,50.45 | v67,46.25 64.3,46.25 63.8,46.75 U4.12 | J3.32 17.7,49.44 17.7,49.45 23.5,49.45 24.05,50 25.5,50 25.95,50.45 | R11.1 v25.95,53.7 25.95,50.45
  Bottom 0.2: v67,46.25 66.5,45.75 58.05,45.75 53.2,50.6 50.3,50.6 49.55,51.35 49.55,54.55 47.15,56.95 46.9,57.2 39.4,57.2 38.5,58.1 30.9,58.1 26.5,53.7 v25.95,53.7
BUFF_CSN  (via drill 0.35)
  Top 0.2: R15.2 19.9,66.2 21.6,64.5 v21.6,61.9
  Bottom 0.2: v21.6,61.9 24.36,61.9 J5.8
BUFF_MISO
  Top 0.2: R13.2 32.27,60.9 J5.4
BUFF_MOSI
  Top 0.2: R14.2 22.8,62.7 25.2,65.1 J5.7
BUFF_SCLK
  Top 0.2: J5.3 32.26,66.5 33.7,66.5 34.8,65.4 42.6,65.4 R12.2
CHGND  (1 unrouted)
FT_USB_N  (via drill 0.3)
  Top 0.26: U1.7 33.15,52.45 v32.9,52.71 | R9.2 48.45,43.3 v49.35,43.3
  Bottom 0.26: v32.9,52.71 32.9,53.1 33.35,53.56 39.47,53.56 49.35,43.68 v49.35,43.3
FT_USB_P  (via drill 0.3)
  Top 0.26: U1.8 32.65,52.06 v32,52.71 | v49.5,40.25 R10.2
  Bottom 0.26: v32,52.71 32,53.64 32.3,53.94 39.63,53.94 50.17,43.4 50.17,41.97 50.17,40.92 v49.5,40.25
GND  (via drill 0.3)
  Top 0.2: U1.15 29.15,51.5 29.25,51.6 C23.2 | v47,15.95 47.15,15.8 U5.14 U5.15 47.65,15.75 v47.85,15.95 | U5.4 48.15,17.15 v47.85,16.85 | U1.11 31.15,49 v30.65,48.5 30.15,49 U1.13
  other vias: 34.15,48.5 33.75,45.9 28.65,43.85 29.1,40.4 26,37.3 23.05,41.6 29.05,34.75 39.15,36.7 29.65,18.95 43.35,30.05 64.25,53.55 59.65,48.75 60.65,41.9 43.7,41.5 57.35,15.6 57.35,13.55 55.4,19.5 51.3,19.7 46.95,16.85 40.15,13.5 35.1,11.65 37.55,13.35 43.3,13.3 33.05,5.75 34,35.1 48.35,27.05 29.15,27.5 36.2,40.45 57.2,45.35 56,55.5 61.4,55.4 29.05,53.1 38.4,50.5 23,43.9 41.65,43.45 37.75,57.25 32.65,55.7 43,55.8 56.3,11.7 56.35,10.65 45.25,21.45 57.45,26.35 29.85,33.1 21.25,29.4 57.1,38.7 25.25,32.45 13,69 73,69 19,69 63,69 32,69 83,69 43,69 53,69 85.5,65 85.5,55 85.5,46 85.5,35 85.5,24 85.5,15 85.5,5 80,1 70,1 60,1 50,1 40,1 25,1 15,1 6,6 1,10 1,20 1,30 1,40 1,50 1,60 6,64 43.15,53.5
  pour Route2: 5.1,70 86.82,70 86.82,0 5.1,0 5.05,0.1 5.05,4.05 4,5.1 0,5.1 0,64.9 3.65,64.9 5.1,66.35
  pour Top: 5.1,70 86.82,70 86.82,0 5.1,0 5.05,0.1 5.05,4.05 4,5.1 0,5.1 0,64.9 3.65,64.9 5.1,66.35
  pour Bottom: 5.1,70 86.82,70 86.82,0 5.1,0 5.05,0.1 5.05,4.05 4,5.1 0,5.1 0,64.9 3.65,64.9 5.1,66.35
H_USB_N
  Top 0.26: R2.2 59.49,56.29 59.75,56.55 59.75,60.42 J9.2
H_USB_P
  Top 0.26: R1.2 58.42,56.53 57.7,57.25 57.7,60.43 J9.3
MAX_CSN  (via drill 0.35)
  Top 0.2: U4.14 64.14,47.74 64.6,48.2 65.6,48.2 v65.7,48.1
  Bottom 0.2: v65.7,48.1 64.6,49.2 60.6,49.2 50.83,58.98 50.35,59.45 49.9,59.9 24.5,59.9 22.8,58.2 22.8,54.5 20.4,52.1 | J3.26 17.49,41.61 17.78,41.9 19.9,41.9 20.4,42.4 20.4,52.1 | 20.4,52.1
MAX_GPX  (via drill 0.41)
  Top 0.2: J3.31 23.96,48.26 v24.8,49.1 | v70.5,48.4 70.5,49.65 69.5,50.65 60.75,50.65 60.7,50.7 60.64,50.64 U4.17
  Bottom 0.2: v70.5,48.4 66.65,44.55 56.2,44.55 52.75,48 50.45,48 48.85,49.6 48.85,54.6 47,56.45 30.25,56.45 24.8,51 v24.8,49.1
MAX_INT  (via drill 0.41)
  Top 0.2: U4.18 60.14,51.24 61.15,52.25 69.3,52.25 71.6,49.95 71.6,48.5 v71.65,48.45 | v24.85,47.9 24.8,47.85 21.18,47.85 21.18,47.84 J3.29
  Bottom 0.2: v71.65,48.45 67.4,44.2 54.25,44.2 53.1,45.35 49.75,45.35 40.1,55 29.7,55 26.2,51.5 26.2,49.25 v24.85,47.9
N$1
  Top 0.2: R1.1 58.42,51.38 58.64,51.16 U4.21
N$2
  Top 0.2: U4.20 59.14,51.14 59.49,51.49 R2.1
N$8
  Top 0.3: C1.1 44.02,16.65 U5.10
N$15
  Top 0.2: U3.1 51.75,24.05 52.58,23.23 C6.1
N$16
  Top 0.2: U3.2 52.77,25.43 53.42,24.77 C6.2
N$17
  Top 0.2: U3.3 52.88,26.09 53.25,26.45 C7.1
N$18
  Top 0.2: U1.9 32.15,51.45 31.3,52.3 C37.1 29.64,54.57 C33.1 L2.2
N$19
  Top 0.2: U3.28 46.13,24.8 45.2,24.8 44.6,25.4 44.02,25.4 44,25.43 C8.1
N$20
  Top 0.2: U3.24 45.19,27.39 44.77,26.98 C8.2
N$21
  Top 0.2: C9.1 47.77,25.02 47.37,25.43 U3.27
N$22
  Top 0.2: U1.4 34.65,53.35 34.2,53.8 C38.1 35.84,54.52 C32.1 | C32.1 | L3.2 C32.1
N$23
  Top 0.2: U1.6 33.65,50.95 33.9,51.2 R5.2
N$24
  Top 0.2: C13.1 23.8,27.7 24,27.9 24,28.2 24.16,28.36 U2.3
N$25
  Top 0.2: U2.2 23.8,29 23.48,29.32 C12.2
N$26
  Top 0.2: U2.1 25.35,30.65 25.1,30.9 22.73,30.9 C12.1
N$27
  Top 0.2: C10.1 33.48,29.3 32.5,29.3 32.15,29.66 U2.28
N$28
  Top 0.2: U2.24 32.05,27.05 32.73,27.73 C10.2
N$29
  Top 0.2: U2.27 29.8,29 29.7,29.1 29.7,31.48 C11.1
N$31  (1 unrouted)
  Top 0.4: J3.17 20.53,30.48 21.25,31.2 21.25,32.3 R4.2 | J3.1
  Top 0.5: R3.2 20.76,8.45 20.76,8.46 J3.1
P1_CTS  (via drill 0.3)
  Top 0.2: U3.18 47.88,31.29 v47.9,31.3 | U1.19 28.6,47.15 28.9,46.85 v29.05,46.85
  Bottom 0.2: v29.05,46.85 31.18,44.73 34.48,44.73 v47.9,31.3
P1_DCD  (via drill 0.3)
  Top 0.2: U3.16 41.81,32.59 v41.7,32.7 | U1.23 28.95,45.15 v30.25,43.85
  Bottom 0.2: v41.7,32.7 41.7,36 34.92,42.77 31.32,42.77 v30.25,43.85
P1_DSR  (via drill 0.3)
  Top 0.2: U3.17 43.53,31.93 v43.5,31.9 | v32,43.7 30.05,45.65 U1.22
  Bottom 0.2: v43.5,31.9 43.5,34.95 34.75,43.7 v32,43.7
P1_DTR  (via drill 0.3)
  Top 0.2: U3.12 49.56,31.93 v46.8,34.7 | U1.21 30.6,46.15 32.45,44.3 36.55,44.3 v36.58,44.33
  Bottom 0.2: v46.8,34.7 40.65,40.85 40.05,40.85 v36.58,44.33
P1_RD  (via drill 0.3)
  Top 0.2: U3.19 49.27,30.64 v49.3,30.6 | U1.17 29.4,48.15 29.86,47.69 v36.42,47.69
  Bottom 0.2: v49.3,30.6 49.3,34.8 v36.41,47.69 v36.42,47.69
P1_RTS  (via drill 0.3)
  Top 0.2: U3.13 50.42,32.59 v48.51,34.5 | U1.18 29.2,47.65 30.02,46.83 v36.18,46.83
  Bottom 0.2: v48.51,34.5 v36.18,46.83
P1_TD  (via drill 0.3)
  Top 0.2: U3.14 51.75,34.65 v51.6,34.8 | v28.7,52.1 28.7,50.02 U1.16
  Bottom 0.2: v51.6,34.8 34.3,52.1 v28.7,52.1
P2_CTS
  Top 0.2: U1.41 32.65,33.95 35.68,30.92 35.68,25.62 33.22,23.16 U2.18
P2_DCD
  Top 0.2: U2.16 33.35,21.86 36.34,24.84 36.34,31.19 35.25,32.27 35.25,37.05 34.65,37.65 U1.45
P2_DSR
  Top 0.2: U2.17 33.5,22.5 36.01,25.01 36.01,31.05 34.91,32.15 34.91,36.85 34.15,37.61 U1.44
P2_DTR  (via drill 0.3)
  Top 0.2: U1.43 33.65,40.35 v33.7,40.4 | v23.7,19.2 22.8,20.1 22.8,22 23.3,22.5 U2.12
  Bottom 0.2: v23.7,19.2 24.3,18.6 26.7,18.6 33.7,25.6 33.7,30.7 32.95,31.45 32.95,37.4 33.7,38.15 v33.7,40.4
P2_RD
  Top 0.2: U1.39 31.65,33.81 35.03,30.43 35.03,25.7 33.13,23.8 U2.19
P2_RTS  (via drill 0.3)
  Top 0.2: U1.40 32.15,40.45 v32.2,40.5 | v25.3,19.78 24.32,19.78 23.8,20.3 23.8,21.5 24.16,21.86 U2.13
  Bottom 0.2: v32.2,40.5 32.2,39.15 31.95,38.9 31.95,24.31 28.12,20.48 27.62,19.98 27.42,19.78 v25.3,19.78
P2_TD  (via drill 0.3)
  Top 0.2: U1.38 31.15,40.35 v31.2,40.4 | v27.7,21.2 U2.14
  Bottom 0.2: v31.2,40.4 31.2,24.7 v27.7,21.2
PI_DM
  Top 0.26: R9.1 49.7,42.25 50.2,42.75 50.2,45.75 51.21,46.76 J10.3
PI_DP
  Top 0.26: R10.1 50.6,41.25 51.51,42.16 J10.4
PI_MISO  (via drill 0.3, 0.35)
  Top 0.2: U4.15 64.04,48.24 64.8,49 67.31,49 v67.4,48.91 | v40.2,58.31 40.2,60.8 R13.1
  Bottom 0.2: v67.4,48.91 65.06,46.57 58.98,46.57 47.52,58.02 47.24,58.31 v40.2,58.31 39.46,59.05 25.25,59.05 23.7,57.5 23.7,53.97 21.6,51.87 21.6,37.3 19.86,35.56 J3.21
PI_MOSI  (via drill 0.3, 0.35)
  Top 0.2: U4.16 63.94,48.74 65,49.8 68.6,49.8 v69,49.4 | v24.7,56.3 22,56.3 21.8,56.5 R14.1
  Bottom 0.2: v69,49.4 68.78,49.4 65.62,46.24 58.61,46.24 47.67,57.17 47.15,57.7 39.6,57.7 38.75,58.55 28.95,58.55 26.7,56.3 v24.7,56.3 24.03,55.63 24.03,53.84 22.18,51.99 22.18,36.13 J3.19
PI_SCLK  (via drill 0.3, 0.35)
  Top 0.2: v64.6,47.2 64.56,47.24 U4.13 | R12.1 45.85,65.35 48.7,62.5 v48.7,58.4
  Bottom 0.2: v64.6,47.2 59.89,47.2 v48.7,58.4 48.25,58.85 48.09,59 47.59,59.5 24.9,59.5 | J3.23 19.2,38.1 21.2,40.1 21.2,52.3 23.2,54.3 23.2,57.8 24.75,59.35 | 24.75,59.35 24.9,59.5 | 24.9,59.5 24.75,59.35
POS_CTS
  Top 0.2: U3.5 54.19,27.39 55.4,28.6 55.85,29.05 56.3,29.5 75.98,29.5 J2.5
POS_DCD  (via drill 0.3, 0.35)
  Top 0.2: v50,28.6 50.09,28.68 U3.7
  Bottom 0.2: v50,28.6 59.17,37.77 60.38,37.77 v60.45,37.7 75.95,37.7 J2.8
POS_DSR
  Top 0.2: U3.6 51.78,28 54.2,28 58.5,32.3 | 58.5,32.3 59,32.3 | 59,32.3 75.95,32.3 J2.6 | 58.5,32.3 59,32.3
POS_DTR
  Top 0.2: U3.11 53.28,31.29 58.38,36.38 J2.20
POS_RD  (via drill 0.35)
  Top 0.2: U3.4 50.13,26.73 v50,26.6
  Bottom 0.2: v50,26.6 52.68,23.92 J2.3
POS_RTS  (via drill 0.35)
  Top 0.2: v55.2,30.6 51.78,30.6 U3.10
  Bottom 0.2: v55.2,30.6 70,30.6 73.91,26.69 J2.4
POS_TD  (via drill 0.3, 0.35)
  Top 0.2: U3.9 51.77,30 53.2,30 53.4,29.8 v54.6,29.8 | v65.55,28.55 72.95,21.15 J2.2
  Bottom 0.2: v54.6,29.8 64.3,29.8 v65.55,28.55
PTR_CTS  (via drill 0.3)
  Top 0.2: U2.5 27.14,27.05 v27.2,27
  Bottom 0.2: v27.2,27 20.7,27 20.3,26.6 11.06,26.6 J1.4
PTR_DSR
  Top 0.2: U2.6 U2.7 20.55,25.75 19.7,26.6 15.2,26.6 12.8,29 12.8,38.65 12.25,39.2 10.25,39.2 9.2,38.15 9.2,37.45 J1.20
PTR_DTR
  Top 0.2: U2.11 22.55,23.16 20.6,21.2 20.6,19.4 20.3,19.1 14.6,19.1 13.95,19.75 10.5,19.75 9.75,20.5 9.75,30.98 10.97,32.2 J1.6 10.97,32.26 9.7,33.53 9.7,36.47 10.97,37.74 J1.8
PTR_RD  (via drill 0.3)
  Top 0.2: U2.4 27,27.7 v27.4,28.1
  Bottom 0.2: v27.4,28.1 28,28.1 28.3,27.8 28.3,23.7 26.1,21.5 11.32,21.5 J1.2
PTR_RTS
  Top 0.2: U2.10 21.5,23.8 21,23.3 21,22.4 20.1,21.5 14.3,21.5 12.9,22.9 12.9,27 12.9,27.18 12.9,27.56 12.87,27.56 J1.5
PTR_TD  (via drill 0.3)
  Top 0.2: U2.9 27.16,24.45 v27.2,24.5
  Bottom 0.2: v27.2,24.5 23.4,24.5 23,24.1 15.3,24.1 15.12,23.92 J1.3
SCR_BUTTN  (via drill 0.41)
  Top 0.2: J3.33 v23.75,50.8 23.85,50.9 R16.1
  Bottom 0.2: J5.5 27.83,66.1 24.5,66.1 17.8,59.4 17.8,52.06 J3.33
SCR_CSN
  Top 0.2: J3.24 14.6,40.02 14.6,65.5 15.3,66.2 R15.1
SCR_LEDN
  Bottom 0.2: J3.37 21.5,58.32 21.5,59.9 22.7,61.1 26.8,61.1 27.81,62.11 J5.6
USB_N
  Top 0.26: J8.2 31.1,5.44 31.26,5.6 31.26,14.53 38.31,21.58 38.31,33.33 46.46,41.49 46.46,42.06 46.65,42.25 R7.1
USB_P
  Top 0.26: J8.3 31.75,5.49 31.64,5.6 31.64,14.37 38.69,21.42 38.69,33.17 46.74,41.21 47.36,41.21 R8.1
VSW
  Top 0.3: C1.2 44,15.1 44.2,14.9 45.9,14.9
  Top 0.35: L1.1 47.67,13 48,13 48.15,13.15 U5.16 48.9,14.9 | L1.1 46.88,12.72 46.65,12.95 U5.13 45.9,14.9 | U5.1 48.9,14.9 | 48.9,14.9 48.9,14.22 D1.C | U5.12 45.9,14.9 | 45.9,14.9 45.9,12.9 47.4,12.9 L1.1
XI
  Top 0.2: U1.2 35.65,51.35 36.47,52.17 C16.1 41.4,50.4 42.9,48.9 45,48.9 X1.1 45.35,48 | C19.1 54.23,48.74 U4.25
  Top 0.4: C19.1 53.17,48.77 52.4,48 45.35,48
XO
  Top 0.2: C18.1 54.8,50.6 55.25,50.15 U4.24 | 44.93,55.17 C17.1 41.37,55.2 40.5,55.2 38.4,53.1 36.45,53.1 35.15,51.8 U1.3 | 44.93,55.17 44.9,55.2 X1.2 | 45.1,55 44.93,55.17
  Top 0.4: C18.1 53.88,51.77 53.3,52.35 53.3,53.35 51.65,55 45.1,55

### Text on the board
tDocu: GT POS Router Placement
DrillLegend: Follow milling instructions. These slots are plated | GT POS Router drill